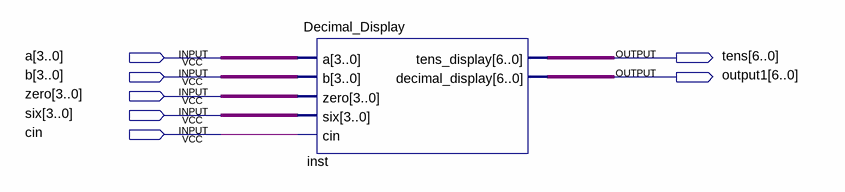
[diagram p0: schematic sheet]
// Quartus schematic Block2.bdf as structural Verilog: 1 symbols, 7 pins
module Block2 (
  input  [3:0] a,
  input  [3:0] b,
  input  [3:0] zero,
  input  [3:0] six,
  input  cin,
  output [6:0] tens,
  output [6:0] output1
);

  Decimal_Display inst (
    .a(a), .b(b), .zero(zero), .six(six), .cin(cin), .tens_display(tens), .decimal_display(output1));
endmodule
